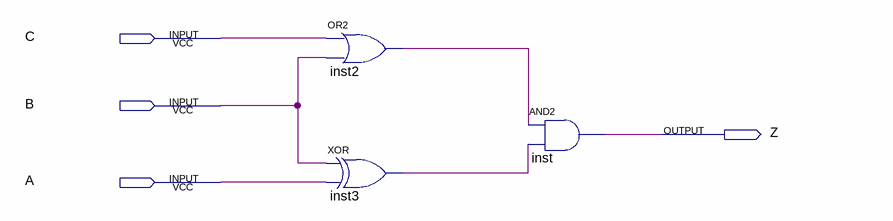
[diagram p0: schematic sheet]
// Quartus schematic Lab1.bdf as structural Verilog: 3 symbols, 4 pins
module Lab1 (
  input  C,
  input  B,
  input  A,
  output Z
);

  wire inst2_out, inst3_out;

  or inst2 (inst2_out, C, B);
  xor inst3 (inst3_out, B, A);
  and inst (Z, inst2_out, inst3_out);
endmodule
